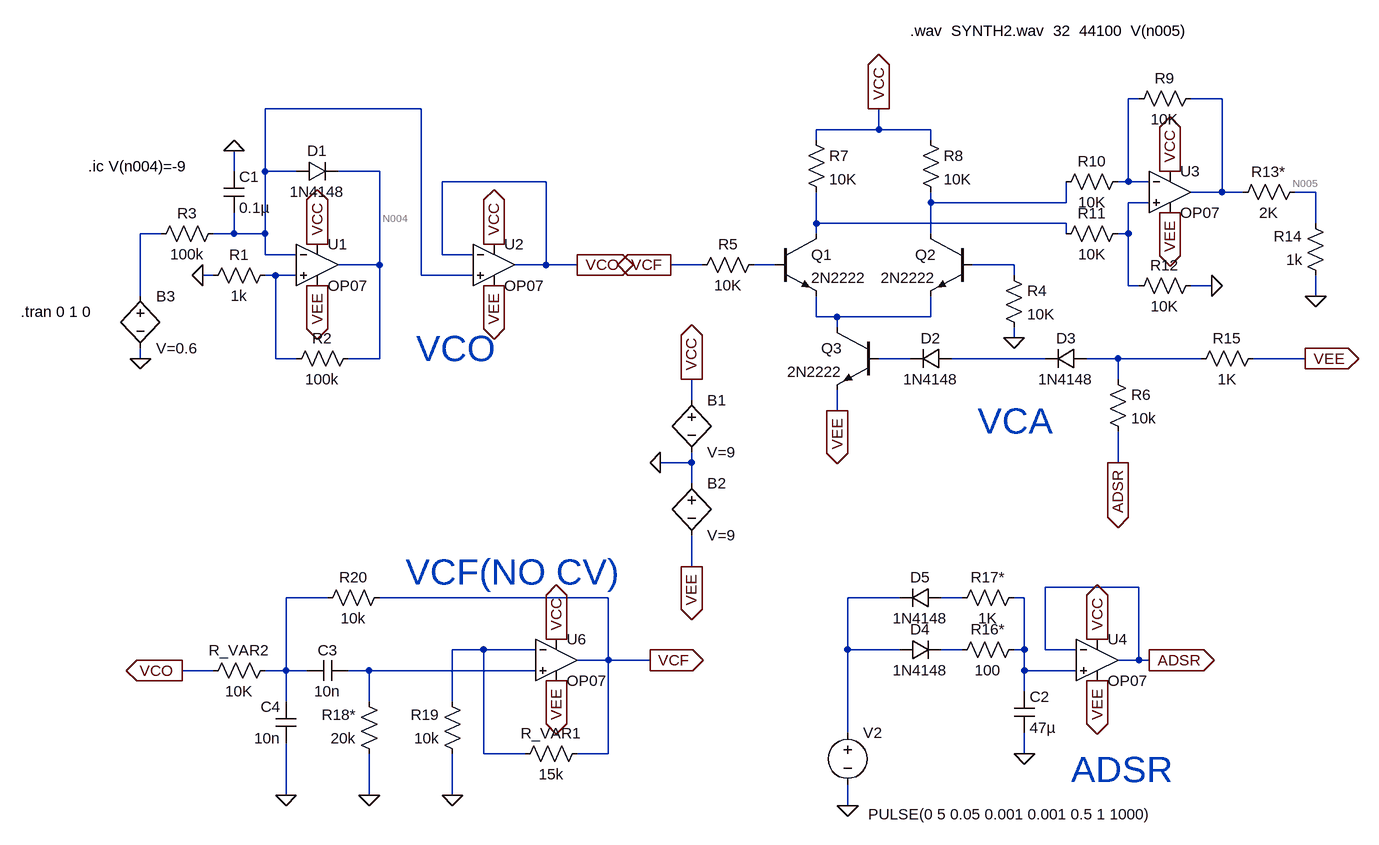
[diagram p0: schematic Synth2_LTspice.asc]
Synth2_LTspice.asc, the LTspice schematic file:
Version 4
SHEET 1 2272 1268
WIRE 1776 -112 1760 -112
WIRE 1904 -112 1856 -112
WIRE 672 -96 432 -96
WIRE 1376 -64 1376 -96
WIRE 1376 -64 1280 -64
WIRE 1456 -64 1376 -64
WIRE 1280 -48 1280 -64
WIRE 1456 -48 1456 -64
WIRE 384 0 384 -32
WIRE 432 0 432 -96
WIRE 480 0 432 0
WIRE 608 0 544 0
WIRE 864 16 704 16
WIRE 1760 16 1760 -112
WIRE 1760 16 1744 16
WIRE 1792 16 1760 16
WIRE 1904 32 1904 -112
WIRE 1904 32 1856 32
WIRE 1936 32 1904 32
WIRE 2048 32 2016 32
WIRE 1456 48 1456 32
WIRE 1664 48 1664 16
WIRE 1664 48 1456 48
WIRE 1792 48 1760 48
WIRE 1280 80 1280 32
WIRE 1664 80 1280 80
WIRE 2048 80 2048 32
WIRE 272 96 240 96
WIRE 384 96 384 64
WIRE 384 96 352 96
WIRE 432 96 432 0
WIRE 432 96 384 96
WIRE 1280 96 1280 80
WIRE 1456 96 1456 48
WIRE 1664 96 1664 80
WIRE 1760 96 1760 48
WIRE 1760 96 1744 96
WIRE 432 128 432 96
WIRE 480 128 432 128
WIRE 704 128 704 16
WIRE 752 128 704 128
WIRE 608 144 608 0
WIRE 608 144 544 144
WIRE 864 144 864 16
WIRE 864 144 816 144
WIRE 912 144 864 144
WIRE 1104 144 1056 144
WIRE 1216 144 1184 144
WIRE 1584 144 1520 144
WIRE 352 160 336 160
WIRE 448 160 432 160
WIRE 480 160 448 160
WIRE 672 160 672 -96
WIRE 752 160 672 160
WIRE 1584 160 1584 144
WIRE 1760 176 1760 96
WIRE 1776 176 1760 176
WIRE 1888 176 1856 176
WIRE 240 192 240 96
WIRE 2048 192 2048 160
WIRE 1280 224 1280 192
WIRE 1312 224 1280 224
WIRE 1456 224 1456 192
WIRE 1456 224 1312 224
WIRE 1312 240 1312 224
WIRE 1584 256 1584 240
WIRE 240 288 240 272
WIRE 448 288 448 160
WIRE 480 288 448 288
WIRE 608 288 608 144
WIRE 608 288 560 288
WIRE 1424 288 1376 288
WIRE 1632 288 1488 288
WIRE 1744 288 1696 288
WIRE 1872 288 1744 288
WIRE 2032 288 1952 288
WIRE 1744 320 1744 288
WIRE 1088 352 1088 320
WIRE 1312 368 1312 336
WIRE 1088 448 1088 432
WIRE 1088 448 1040 448
WIRE 1744 448 1744 400
WIRE 1088 480 1088 448
WIRE 1088 608 1088 560
WIRE 1776 640 1632 640
WIRE 528 656 464 656
WIRE 960 656 608 656
WIRE 1408 656 1328 656
WIRE 1504 656 1472 656
WIRE 1600 656 1584 656
WIRE 768 736 720 736
WIRE 848 736 768 736
WIRE 1328 736 1328 656
WIRE 1408 736 1328 736
WIRE 1504 736 1472 736
WIRE 1600 736 1600 656
WIRE 1600 736 1584 736
WIRE 1632 736 1632 640
WIRE 1680 736 1632 736
WIRE 960 752 960 656
WIRE 960 752 912 752
WIRE 1024 752 960 752
WIRE 1776 752 1776 640
WIRE 1776 752 1744 752
WIRE 1792 752 1776 752
WIRE 352 768 304 768
WIRE 464 768 464 656
WIRE 464 768 432 768
WIRE 496 768 464 768
WIRE 592 768 560 768
WIRE 848 768 592 768
WIRE 1600 768 1600 736
WIRE 1680 768 1600 768
WIRE 1600 800 1600 768
WIRE 464 816 464 768
WIRE 592 816 592 768
WIRE 720 816 720 736
WIRE 1328 864 1328 736
WIRE 768 896 768 736
WIRE 832 896 768 896
WIRE 960 896 960 752
WIRE 960 896 912 896
WIRE 1600 896 1600 864
WIRE 464 960 464 880
WIRE 592 960 592 896
WIRE 720 960 720 896
WIRE 1328 976 1328 944
FLAG 1040 448 0
FLAG 1088 320 VCC
IOPIN 1088 320 Out
FLAG 1088 608 VEE
IOPIN 1088 608 Out
FLAG 512 112 VCC
IOPIN 512 112 Out
FLAG 512 176 VEE
IOPIN 512 176 Out
FLAG 240 288 0
FLAG 336 160 0
FLAG 784 112 VCC
IOPIN 784 112 Out
FLAG 784 176 VEE
IOPIN 784 176 Out
FLAG 384 -32 0
FLAG 912 144 VCO
IOPIN 912 144 Out
FLAG 1376 -96 VCC
IOPIN 1376 -96 Out
FLAG 1584 256 0
FLAG 1312 368 VEE
IOPIN 1312 368 Out
FLAG 304 768 VCO
IOPIN 304 768 Out
FLAG 1824 0 VCC
IOPIN 1824 0 Out
FLAG 1824 64 VEE
IOPIN 1824 64 Out
FLAG 1888 176 0
FLAG 2048 192 0
FLAG 2032 288 VEE
IOPIN 2032 288 Out
FLAG 1712 720 VCC
IOPIN 1712 720 Out
FLAG 1712 784 VEE
IOPIN 1712 784 Out
FLAG 1328 976 0
FLAG 1600 896 0
FLAG 1744 448 ADSR
IOPIN 1744 448 Out
FLAG 1792 752 ADSR
IOPIN 1792 752 Out
FLAG 464 960 0
FLAG 592 960 0
FLAG 720 960 0
FLAG 880 720 VCC
IOPIN 880 720 Out
FLAG 880 784 VEE
IOPIN 880 784 Out
FLAG 1024 752 VCF
IOPIN 1024 752 Out
FLAG 1056 144 VCF
IOPIN 1056 144 Out
SYMBOL bv 1088 336 R0
SYMATTR InstName B1
SYMATTR Value V=9
SYMBOL bv 1088 464 R0
SYMATTR InstName B2
SYMATTR Value V=9
SYMBOL OpAmps\\OP07 512 80 R0
SYMATTR InstName U1
SYMBOL res 448 144 R90
WINDOW 0 0 56 VBottom 2
WINDOW 3 32 56 VTop 2
SYMATTR InstName R1
SYMATTR Value 1k
SYMBOL res 576 272 R90
WINDOW 0 0 56 VBottom 2
WINDOW 3 32 56 VTop 2
SYMATTR InstName R2
SYMATTR Value 100k
SYMBOL bv 240 176 R0
SYMATTR InstName B3
SYMATTR Value V=0.6
SYMBOL cap 368 0 R0
SYMATTR InstName C1
SYMATTR Value 0.1µ
SYMBOL res 368 80 R90
WINDOW 0 0 56 VBottom 2
WINDOW 3 32 56 VTop 2
SYMATTR InstName R3
SYMATTR Value 100k
SYMBOL diode 480 16 R270
WINDOW 0 32 32 VTop 2
WINDOW 3 0 32 VBottom 2
SYMATTR InstName D1
SYMATTR Value 1N4148
SYMBOL OpAmps\\OP07 784 80 R0
SYMATTR InstName U2
SYMBOL npn 1216 96 R0
SYMATTR InstName Q1
SYMATTR Value 2N2222
SYMBOL npn 1520 96 M0
SYMATTR InstName Q2
SYMATTR Value 2N2222
SYMBOL npn 1376 240 M0
SYMATTR InstName Q3
SYMATTR Value 2N2222
SYMBOL res 1568 144 R0
SYMATTR InstName R4
SYMATTR Value 10K
SYMBOL res 1200 128 R90
WINDOW 0 0 56 VBottom 2
WINDOW 3 32 56 VTop 2
SYMATTR InstName R5
SYMATTR Value 10K
SYMBOL diode 1488 272 R90
WINDOW 0 0 32 VBottom 2
WINDOW 3 32 32 VTop 2
SYMATTR InstName D2
SYMATTR Value 1N4148
SYMBOL diode 1696 272 R90
WINDOW 0 0 32 VBottom 2
WINDOW 3 32 32 VTop 2
SYMATTR InstName D3
SYMATTR Value 1N4148
SYMBOL res 1728 304 R0
SYMATTR InstName R6
SYMATTR Value 10k
SYMBOL res 1264 -64 R0
SYMATTR InstName R7
SYMATTR Value 10K
SYMBOL res 1440 -64 R0
SYMATTR InstName R8
SYMATTR Value 10K
SYMBOL OpAmps\\OP07 1824 -32 R0
SYMATTR InstName U3
SYMBOL res 1872 -128 R90
WINDOW 0 0 56 VBottom 2
WINDOW 3 32 56 VTop 2
SYMATTR InstName R9
SYMATTR Value 10K
SYMBOL res 1760 0 R90
WINDOW 0 0 56 VBottom 2
WINDOW 3 32 56 VTop 2
SYMATTR InstName R10
SYMATTR Value 10K
SYMBOL res 1760 80 R90
WINDOW 0 0 56 VBottom 2
WINDOW 3 32 56 VTop 2
SYMATTR InstName R11
SYMATTR Value 10K
SYMBOL res 1872 160 R90
WINDOW 0 0 56 VBottom 2
WINDOW 3 32 56 VTop 2
SYMATTR InstName R12
SYMATTR Value 10K
SYMBOL res 2032 16 R90
WINDOW 0 0 56 VBottom 2
WINDOW 3 32 56 VTop 2
SYMATTR InstName R13*
SYMATTR Value 2K
SYMBOL res 2064 176 R180
WINDOW 0 36 76 Left 2
WINDOW 3 36 40 Left 2
SYMATTR InstName R14
SYMATTR Value 1k
SYMBOL res 1968 272 R90
WINDOW 0 0 56 VBottom 2
WINDOW 3 32 56 VTop 2
SYMATTR InstName R15
SYMATTR Value 1K
SYMBOL OpAmps\\OP07 1712 688 R0
SYMATTR InstName U4
SYMBOL voltage 1328 848 R0
WINDOW 3 32 141 Left 2
WINDOW 123 0 0 Left 0
WINDOW 39 0 0 Left 0
SYMATTR Value PULSE(0 5 0.05 0.001 0.001 0.5 1 1000)
SYMATTR InstName V2
SYMBOL res 1600 720 R90
WINDOW 0 0 56 VBottom 2
WINDOW 3 32 56 VTop 2
SYMATTR InstName R16*
SYMATTR Value 100
SYMBOL cap 1584 800 R0
SYMATTR InstName C2
SYMATTR Value 47µ
SYMBOL diode 1408 752 R270
WINDOW 0 32 32 VTop 2
WINDOW 3 0 32 VBottom 2
SYMATTR InstName D4
SYMATTR Value 1N4148
SYMBOL diode 1472 640 R90
WINDOW 0 0 32 VBottom 2
WINDOW 3 32 32 VTop 2
SYMATTR InstName D5
SYMATTR Value 1N4148
SYMBOL res 1600 640 R90
WINDOW 0 0 56 VBottom 2
WINDOW 3 32 56 VTop 2
SYMATTR InstName R17*
SYMATTR Value 1K
SYMBOL res 608 912 R180
WINDOW 0 36 76 Left 2
WINDOW 3 36 40 Left 2
SYMATTR InstName R18*
SYMATTR Value 20k
SYMBOL cap 560 752 R90
WINDOW 0 0 32 VBottom 2
WINDOW 3 32 32 VTop 2
SYMATTR InstName C3
SYMATTR Value 10n
SYMBOL res 624 640 R90
WINDOW 0 0 56 VBottom 2
WINDOW 3 32 56 VTop 2
SYMATTR InstName R20
SYMATTR Value 10k
SYMBOL OpAmps\\OP07 880 688 R0
SYMATTR InstName U6
SYMBOL res 816 912 R270
WINDOW 0 32 56 VTop 2
WINDOW 3 0 56 VBottom 2
SYMATTR InstName R_VAR1
SYMATTR Value 15k
SYMBOL res 736 912 R180
WINDOW 0 36 76 Left 2
WINDOW 3 36 40 Left 2
SYMATTR InstName R19
SYMATTR Value 10k
SYMBOL cap 480 880 R180
WINDOW 0 24 56 Left 2
WINDOW 3 24 8 Left 2
SYMATTR InstName C4
SYMATTR Value 10n
SYMBOL res 336 784 R270
WINDOW 0 32 56 VTop 2
WINDOW 3 0 56 VBottom 2
SYMATTR InstName R_VAR2
SYMATTR Value 10K
TEXT 56 216 Left 2 !.tran 0 1 0
TEXT 160 -8 Left 2 !.ic V(n004)=-9
TEXT 664 272 Left 5 ;VCO
TEXT 1528 384 Left 5 ;VCA
TEXT 1424 -216 Left 2 !.wav  SYNTH2.wav  32  44100  V(n005)
TEXT 1672 920 Left 5 ;ADSR
TEXT 648 616 Left 5 ;VCF(NO CV)

The netlist it stands for:
* Synth2_LTspice.asc
B1 VCC 0 V=9
B2 0 VEE V=9
XU1 N012 N003 VCC VEE N004 LT1001  ; OP07, pins In+ In- V+ V- OUT
R1 N012 0 1k
R2 N004 N012 100k
B3 N009 0 V=0.6
C1 0 N003 0.1µ
R3 N003 N009 100k
D1 N003 N004 1N4148
XU2 N003 VCO VCC VEE VCO LT1001  ; OP07, pins In+ In- V+ V- OUT
Q1 N008 N010 N013 0 2N2222
Q2 N006 N011 N013 0 2N2222
Q3 N013 N014 VEE 0 2N2222
R4 N011 0 10K
R5 N010 VCF 10K
D2 N015 N014 1N4148
D3 N016 N015 1N4148
R6 N016 ADSR 10k
R7 VCC N008 10K
R8 VCC N006 10K
XU3 N007 N001 VCC VEE N002 LT1001  ; OP07, pins In+ In- V+ V- OUT
R9 N002 N001 10K
R10 N001 N006 10K
R11 N007 N008 10K
R12 0 N007 10K
R13* N005 N002 2K
R14 0 N005 1k
R15 VEE N016 1K
XU4 N020 ADSR VCC VEE ADSR LT1001  ; OP07, pins In+ In- V+ V- OUT
V2 N018 0 PULSE(0 5 0.05 0.001 0.001 0.5 1 1000)
R16* N020 N022 100
C2 N020 0 47µ
D4 N018 N022 1N4148
D5 N019 N018 1N4148
R17* N020 N019 1K
R18* 0 N023 20k
C3 N023 N017 10n
R20 VCF N017 10k
XU6 N023 N021 VCC VEE VCF LT1001  ; OP07, pins In+ In- V+ V- OUT
R_VAR1 N021 VCF 15k
R19 0 N021 10k
C4 0 N017 10n
R_VAR2 VCO N017 10K
.model D D
.lib standard.dio
.model NPN NPN
.model PNP PNP
.lib standard.bjt
.tran 0 1 0
.ic V(n004)=-9
* VCO
* VCA
.wav  SYNTH2.wav  32  44100  V(n005)
* ADSR
* VCF(NO CV)
.lib LTC.lib
.backanno
.end